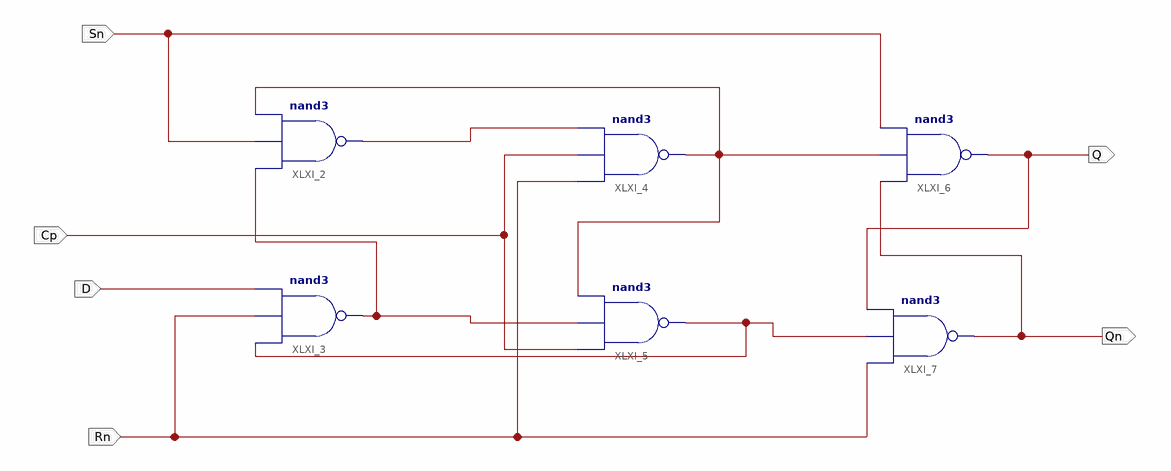
[diagram p0: schematic sheet 1]
// Xilinx ISE schematic MB_DFF.sch (spartan3) as structural Verilog: 6 symbols, 6 ports
module MB_DFF (
  input  Sn,
  input  Cp,
  input  D,
  input  Rn,
  output Q,
  output Qn
);

  wire XLXN_11, XLXN_12, XLXN_13, XLXN_22;

  nand XLXI_2 (XLXN_13, XLXN_12, Sn, XLXN_11);
  nand XLXI_3 (XLXN_12, XLXN_22, Rn, D);
  nand XLXI_4 (XLXN_11, Rn, Cp, XLXN_13);
  nand XLXI_5 (XLXN_22, Cp, XLXN_12, XLXN_11);
  nand XLXI_6 (Q, Qn, XLXN_11, Sn);
  nand XLXI_7 (Qn, Rn, XLXN_22, Q);
endmodule
